# Altium schematic sheet Main.SchDoc: Actuators
size A1; SheetNumber: 1; SheetTotal: 1
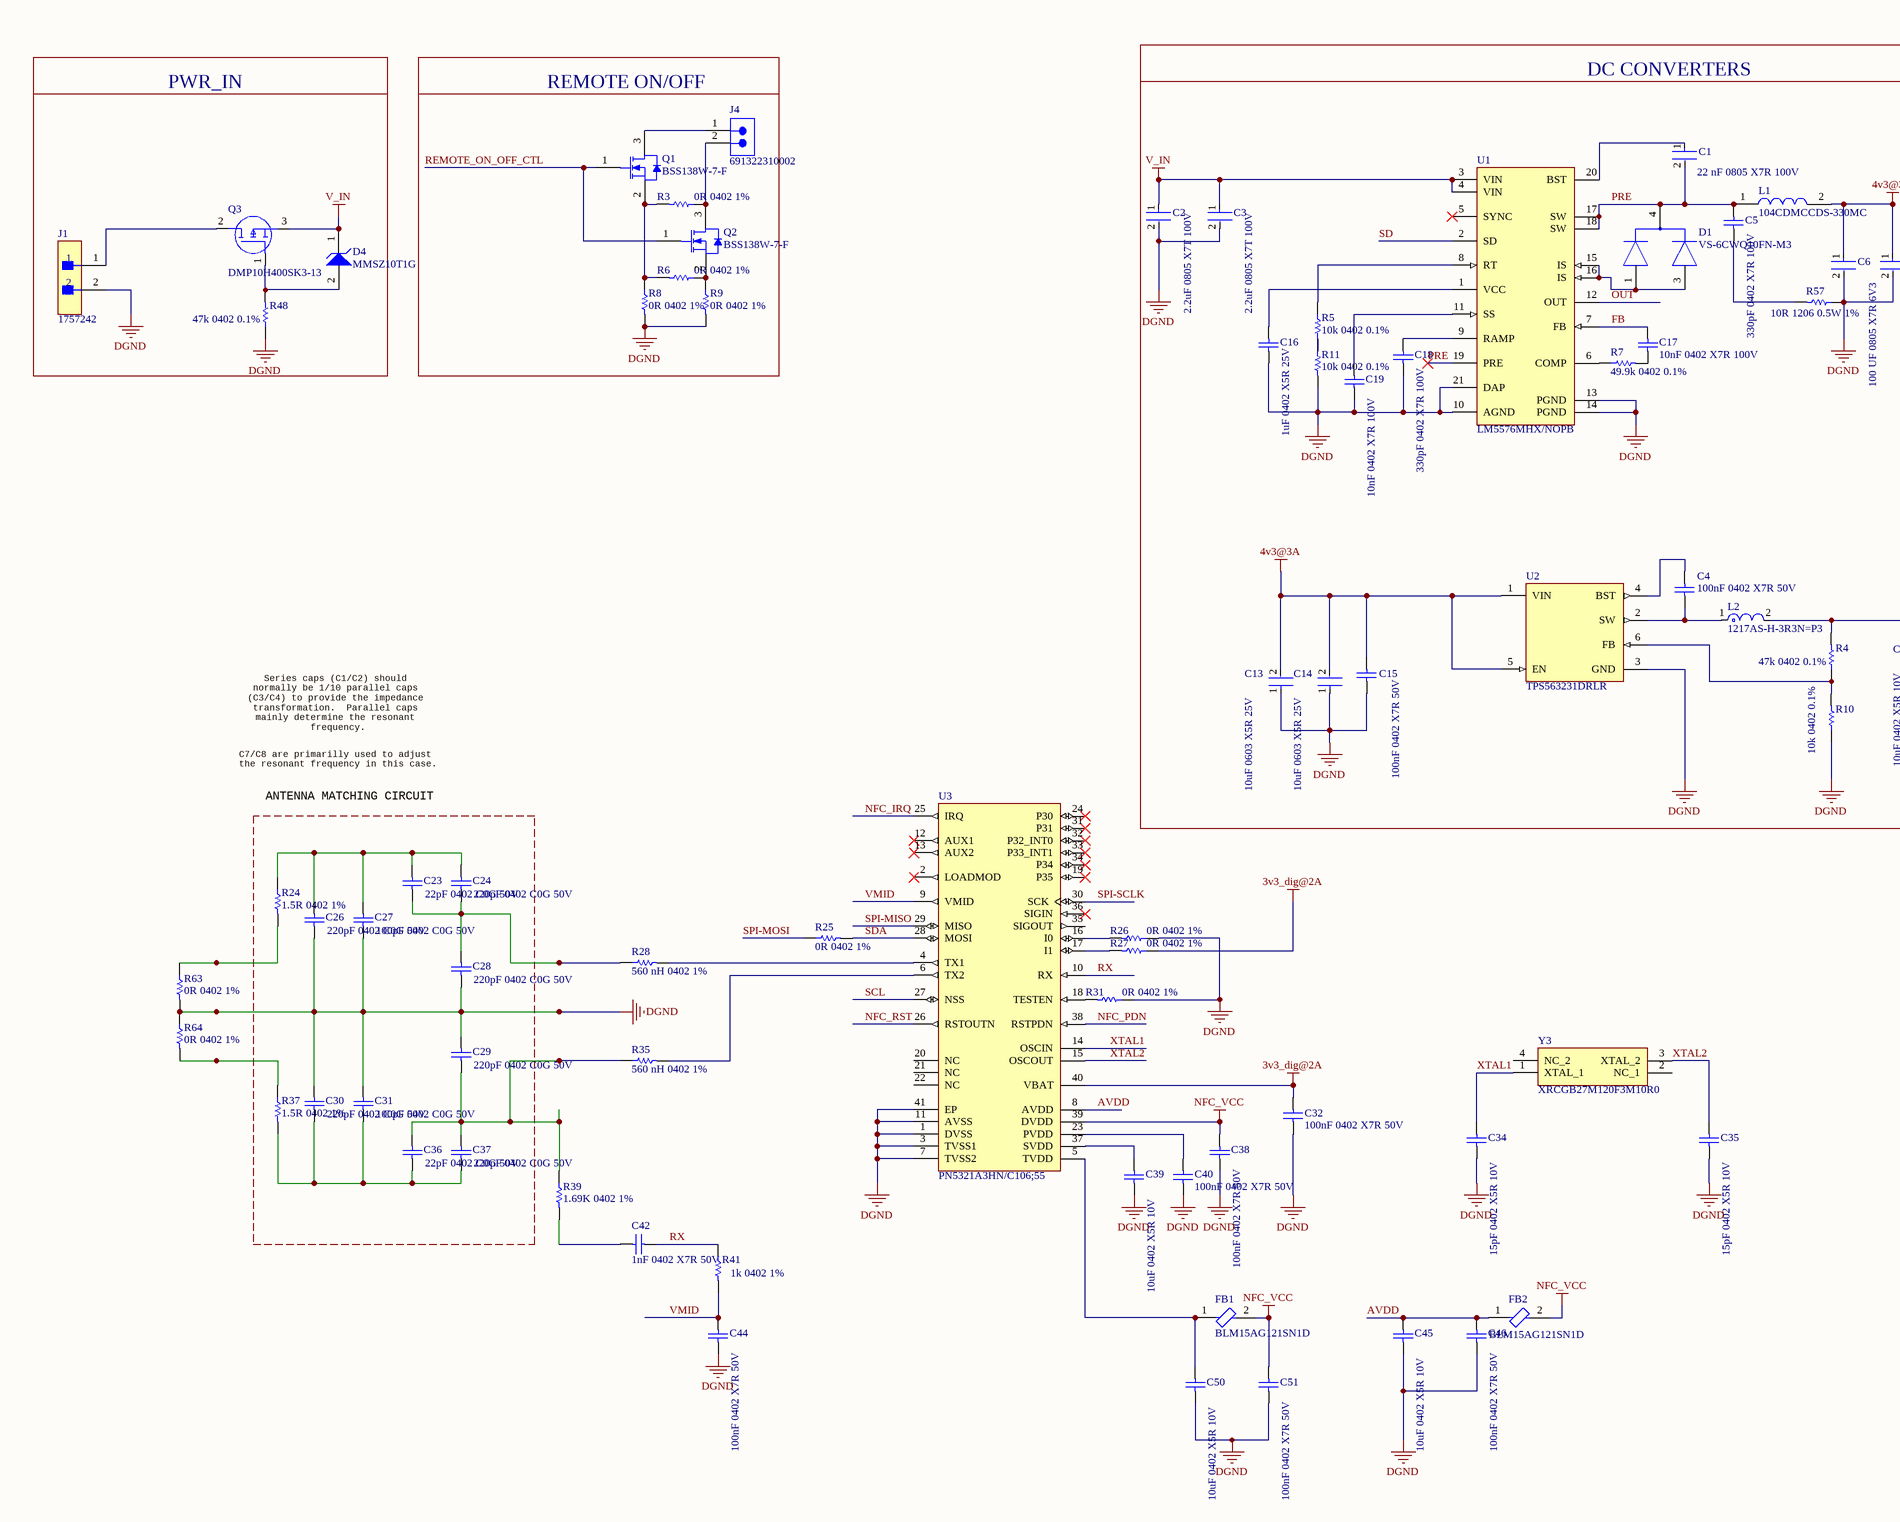
[diagram p0: Main.SchDoc, top left]
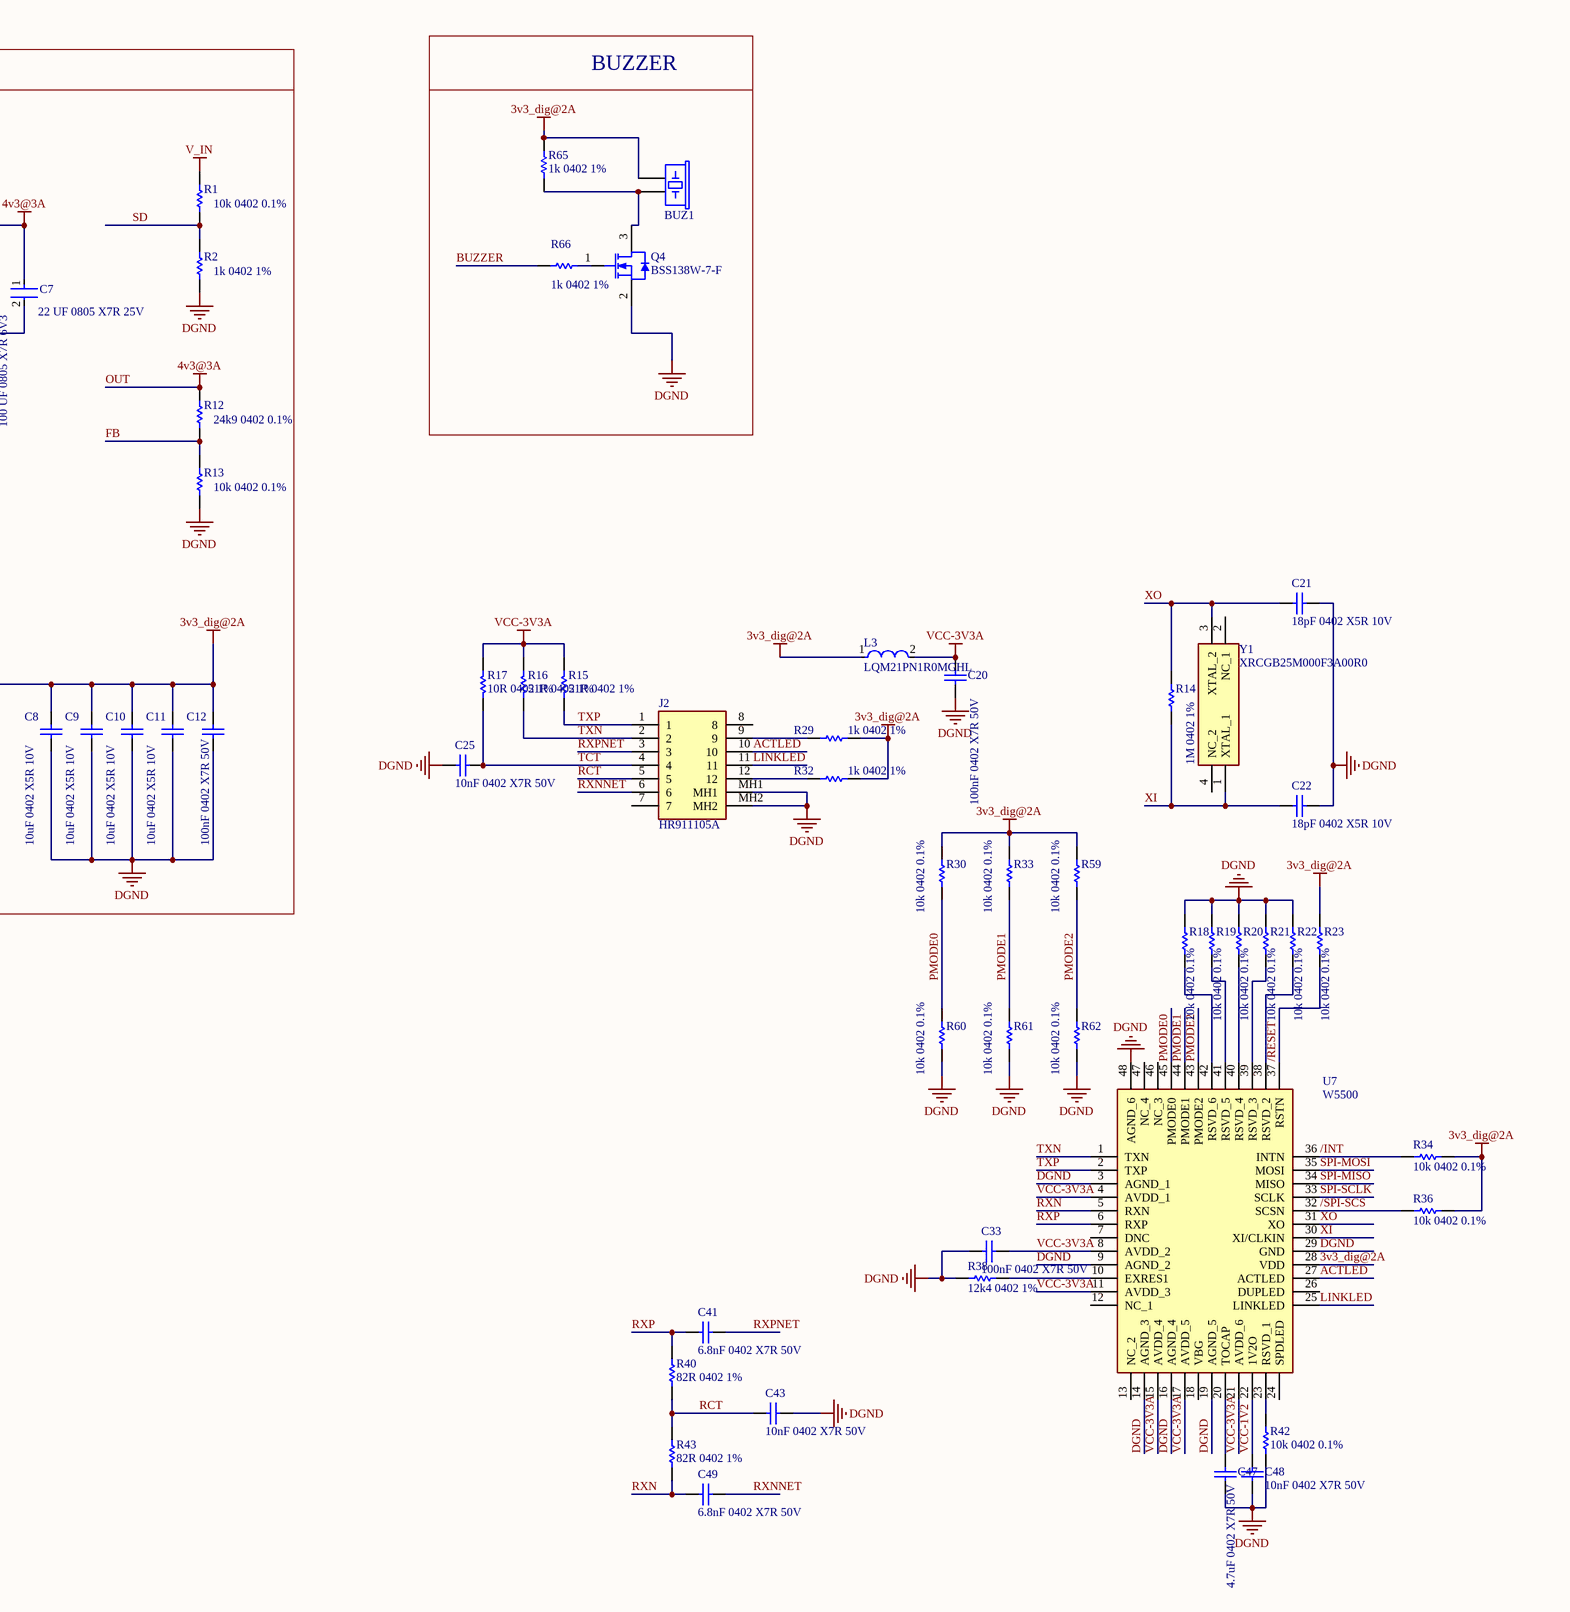
[diagram p1: Main.SchDoc, top right]
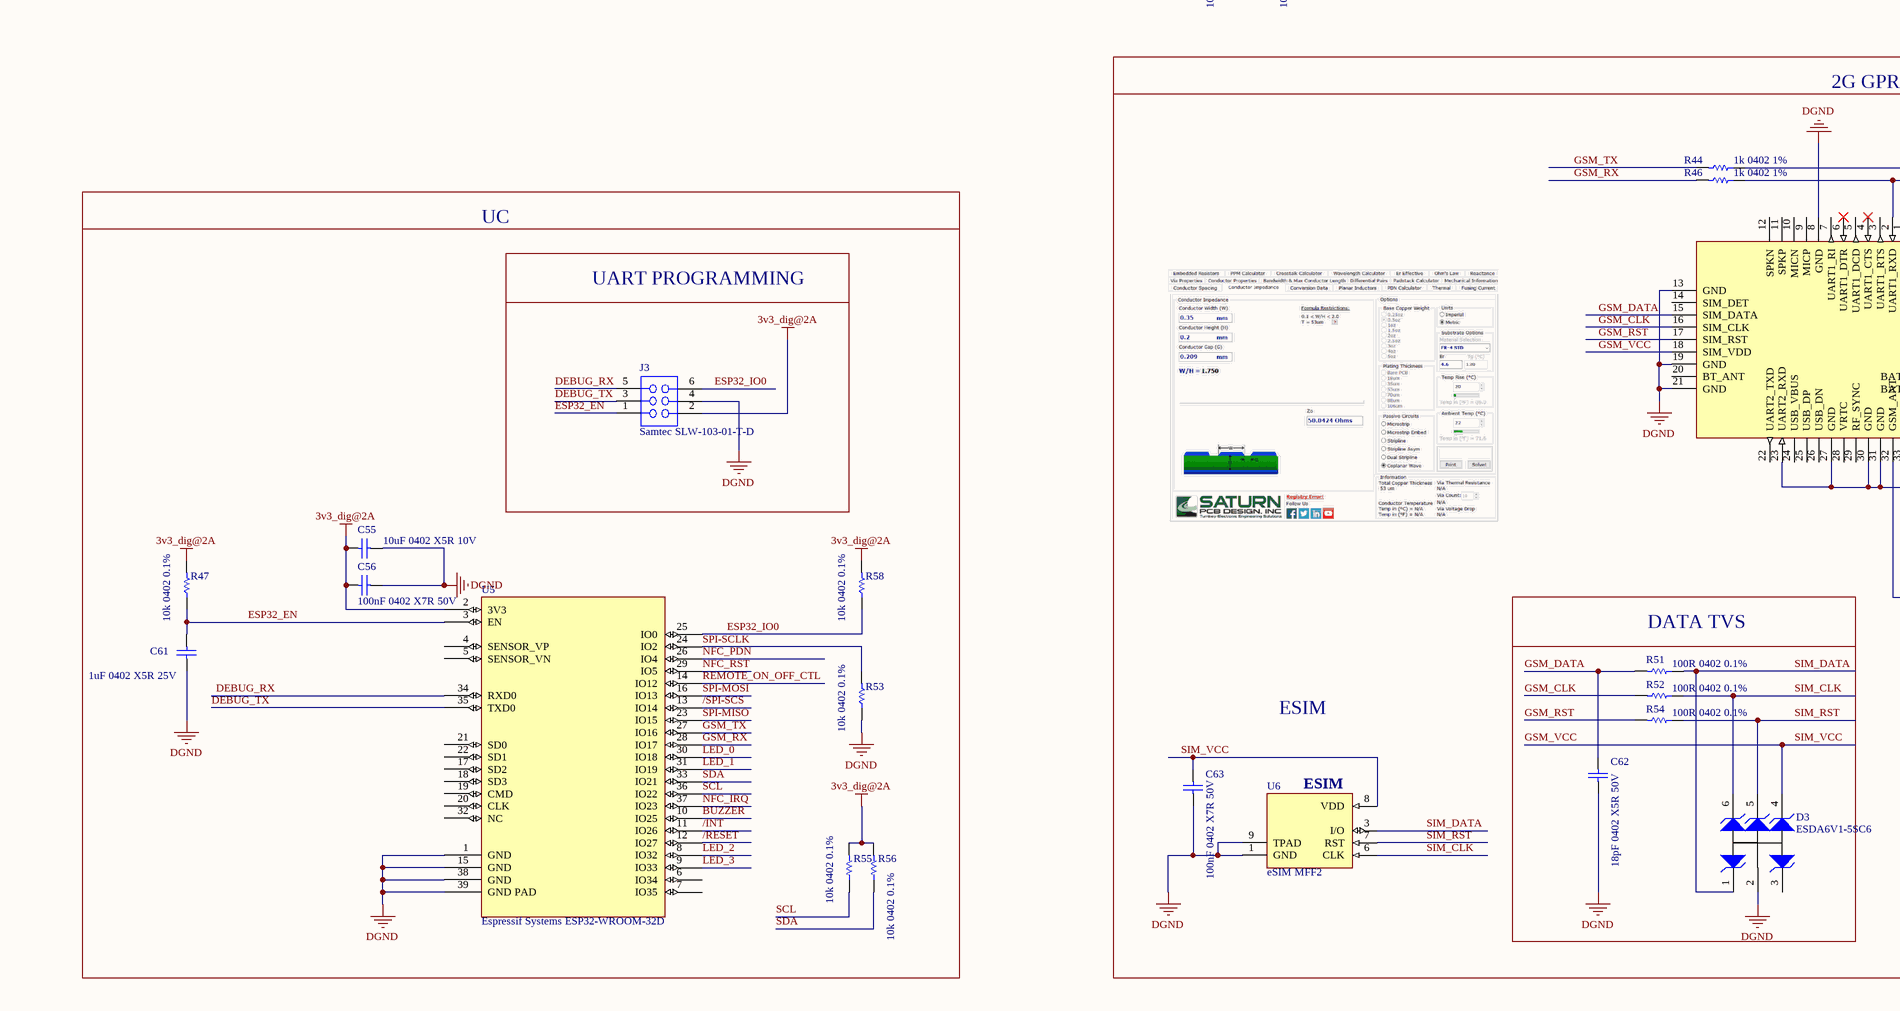
[diagram p2: Main.SchDoc, bottom left]
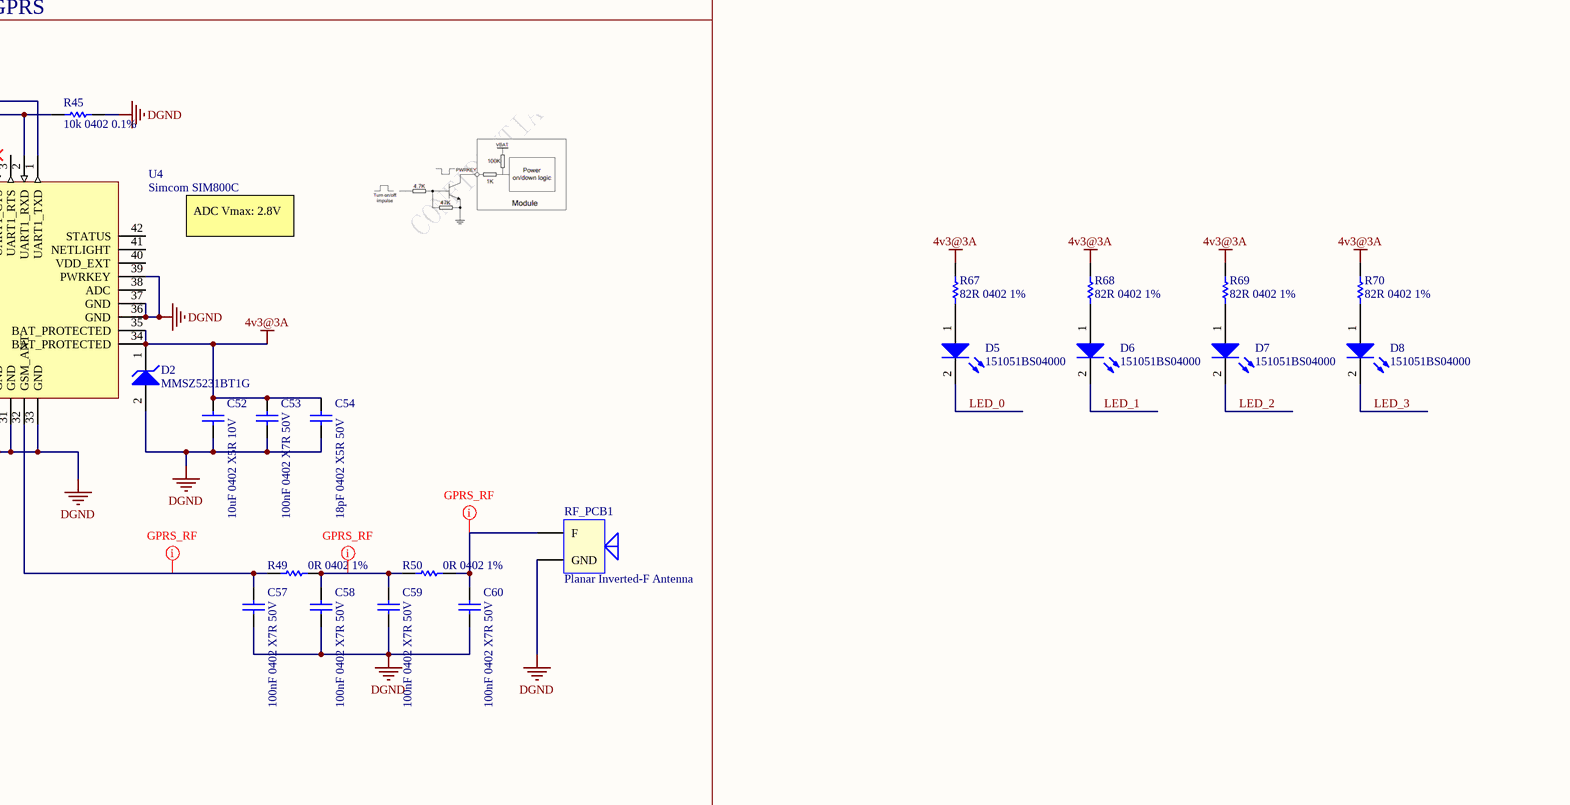
[diagram p3: Main.SchDoc, bottom right]

## Parts
BUZ1  CUI CMT-1285C-035  [BUZZER-12MM-NS]  (value not drawn)
C1  22 nF 0805 X7R 100V  [FP-GRM21B-0_15-IPC_C]
C2  2.2uF 0805 X7T 100V  [FP-GRM21B-0_15-IPC_C]
C3  2.2uF 0805 X7T 100V  [FP-GRM21B-0_15-IPC_C]
C4  100nF 0402 X7R 50V  [CAPC1005X55X25NL5T10]
C5  330pF 0402 X7R 100V  [CAPC1005X55X25NL5T10]
C6  100 UF 0805 X7R 6V3  [FP-GRM21B-0_15-IPC_C]
C7  22 UF 0805 X7R 25V  [FP-GRM21B-0_15-IPC_C]
C8  10uF 0402 X5R 10V  [CAPC1005X55X25NL5T10]
C9  10uF 0402 X5R 10V  [CAPC1005X55X25NL5T10]
C10  10uF 0402 X5R 10V  [CAPC1005X55X25NL5T10]
C11  10uF 0402 X5R 10V  [CAPC1005X55X25NL5T10]
C12  100nF 0402 X7R 50V  [CAPC1005X55X25NL5T10]
C13  10uF 0603 X5R 25V  [FP-GRM188-0_2-IPC_B]
C14  10uF 0603 X5R 25V  [FP-GRM188-0_2-IPC_B]
C15  100nF 0402 X7R 50V  [CAPC1005X55X25NL5T10]
C16  1uF 0402 X5R 25V  [CAPC1005X55X25NL5T10]
C17  10nF 0402 X7R 100V  [CAPC1005X55X25NL5T10]
C18  330pF 0402 X7R 100V  [CAPC1005X55X25NL5T10]
C19  10nF 0402 X7R 100V  [CAPC1005X55X25NL5T10]
C20  100nF 0402 X7R 50V  [CAPC1005X55X25NL5T10]
C21  18pF 0402 X5R 10V  [CAPC1005X55X25NL5T10]
C22  18pF 0402 X5R 10V  [CAPC1005X55X25NL5T10]
C23  22pF 0402 C0G 50V  [CAPC1005X55X25NL5T10]
C24  220pF 0402 C0G 50V  [CAPC1005X55X25NL5T10]
C25  10nF 0402 X7R 50V  [CAPC1005X55X25NL5T10]
C26  220pF 0402 C0G 50V  [CAPC1005X55X25NL5T10]
C27  100pF 0402 C0G 50V  [CAPC1005X55X25NL5T10]
C28  220pF 0402 C0G 50V  [CAPC1005X55X25NL5T10]
C29  220pF 0402 C0G 50V  [CAPC1005X55X25NL5T10]
C30  220pF 0402 C0G 50V  [CAPC1005X55X25NL5T10]
C31  100pF 0402 C0G 50V  [CAPC1005X55X25NL5T10]
C32  100nF 0402 X7R 50V  [CAPC1005X55X25NL5T10]
C33  100nF 0402 X7R 50V  [CAPC1005X55X25NL5T10]
C34  15pF 0402 X5R 10V  [CAPC1005X55X25NL5T10]
C35  15pF 0402 X5R 10V  [CAPC1005X55X25NL5T10]
C36  22pF 0402 C0G 50V  [CAPC1005X55X25NL5T10]
C37  220pF 0402 C0G 50V  [CAPC1005X55X25NL5T10]
C38  100nF 0402 X7R 50V  [CAPC1005X55X25NL5T10]
C39  10uF 0402 X5R 10V  [CAPC1005X55X25NL5T10]
C40  100nF 0402 X7R 50V  [CAPC1005X55X25NL5T10]
C41  6.8nF 0402 X7R 50V  [CAPC1005X55X25NL5T10]
C42  1nF 0402 X7R 50V  [CAPC1005X55X25NL5T10]
C43  10nF 0402 X7R 50V  [CAPC1005X55X25NL5T10]
C44  100nF 0402 X7R 50V  [CAPC1005X55X25NL5T10]
C45  10uF 0402 X5R 10V  [CAPC1005X55X25NL5T10]
C46  100nF 0402 X7R 50V  [CAPC1005X55X25NL5T10]
C47  4.7uF 0402 X7R 50V  [CAPC1005X55X25NL5T10]
C48  10nF 0402 X7R 50V  [CAPC1005X55X25NL5T10]
C49  6.8nF 0402 X7R 50V  [CAPC1005X55X25NL5T10]
C50  10uF 0402 X5R 10V  [CAPC1005X55X25NL5T10]
C51  100nF 0402 X7R 50V  [CAPC1005X55X25NL5T10]
C52  10uF 0402 X5R 10V  [CAPC1005X55X25NL5T10]
C53  100nF 0402 X7R 50V  [CAPC1005X55X25NL5T10]
C54  18pF 0402 X5R 50V  [CAPC1005X55X25NL5T10]
C55  10uF 0402 X5R 10V  [CAPC1005X55X25NL5T10]
C56  100nF 0402 X7R 50V  [CAPC1005X55X25NL5T10]
C57  100nF 0402 X7R 50V  [CAPC1005X55X25NL5T10]
C58  100nF 0402 X7R 50V  [CAPC1005X55X25NL5T10]
C59  100nF 0402 X7R 50V  [CAPC1005X55X25NL5T10]
C60  100nF 0402 X7R 50V  [CAPC1005X55X25NL5T10]
C61  1uF 0402 X5R 25V  [CAPC1005X55X25NL5T10]
C62  18pF 0402 X5R 50V  [CAPC1005X55X25NL5T10]
C63  100nF 0402 X7R 50V  [CAPC1005X55X25NL5T10]
D1  VS-6CWQ10FN-M3  [FP-95627-0]
D2  MMSZ5231BT1G  [ONSC-SOD-123-2-425-04_V]
D3  ESDA6V1-5SC6  [MF06A_N]
D4  MMSZ10T1G  [ONSC-SOD-123-2-425-04_V]
D5  151051BS04000  [WL-TMRC_D5.9H8.7]
D6  151051BS04000  [WL-TMRC_D5.9H8.7]
D7  151051BS04000  [WL-TMRC_D5.9H8.7]
D8  151051BS04000  [WL-TMRC_D5.9H8.7]
FB1  BLM15AG121SN1D  [FP-BLM15-0_05-MFG]
FB2  BLM15AG121SN1D  [FP-BLM15-0_05-MFG]
J1  1757242  [FP-1757242-MFG]
J2  HR911105A  [HR911105A]
J3  Samtec SLW-103-01-T-D  [PCB-37z8hw1ej4f71bosen9e-1]
J4  691322310002  [691322310002]
L1  104CDMCCDS-330MC  [INDPM115100X400N]
L2  1217AS-H-3R3N=P3  [FP-DEM8045C-MFG]
L3  LQM21PN1R0MGHL  [FP-LQM21PH_G0-MFG]
Q1  BSS138W-7-F  [DIOD-SOT323-3_V]
Q2  BSS138W-7-F  [DIOD-SOT323-3_V]
Q3  DMP10H400SK3-13  [DMP10H400SK313]
Q4  BSS138W-7-F  [DIOD-SOT323-3_V]
R1  10k 0402 0.1%  [RESC1005X40X25ML05T10]
R2  1k 0402 1%  [RESC1005X40X25ML05T10]
R3  0R 0402 1%  [RESC1005X40X25ML05T10]
R4  47k 0402 0.1%  [RESC1005X40X25ML05T10]
R5  10k 0402 0.1%  [RESC1005X40X25ML05T10]
R6  0R 0402 1%  [RESC1005X40X25ML05T10]
R7  49.9k 0402 0.1%  [RESC1005X40X25ML05T10]
R8  0R 0402 1%  [RESC1005X40X25ML05T10]
R9  0R 0402 1%  [RESC1005X40X25ML05T10]
R10  10k 0402 0.1%  [RESC1005X40X25ML05T10]
R11  10k 0402 0.1%  [RESC1005X40X25ML05T10]
R12  24k9 0402 0.1%  [RESC1005X40X25ML05T10]
R13  10k 0402 0.1%  [RESC1005X40X25ML05T10]
R14  1M 0402 1%  [RESC1005X40X25ML05T10]
R15  51R 0402 1%  [RESC1005X40X25ML05T10]
R16  51R 0402 1%  [RESC1005X40X25ML05T10]
R17  10R 0402 1%  [RESC1005X40X25ML05T10]
R18  10k 0402 0.1%  [RESC1005X40X25ML05T10]
R19  10k 0402 0.1%  [RESC1005X40X25ML05T10]
R20  10k 0402 0.1%  [RESC1005X40X25ML05T10]
R21  10k 0402 0.1%  [RESC1005X40X25ML05T10]
R22  10k 0402 0.1%  [RESC1005X40X25ML05T10]
R23  10k 0402 0.1%  [RESC1005X40X25ML05T10]
R24  1.5R 0402 1%  [RESC1005X40X25ML05T10]
R25  0R 0402 1%  [RESC1005X40X25ML05T10]
R26  0R 0402 1%  [RESC1005X40X25ML05T10]
R27  0R 0402 1%  [RESC1005X40X25ML05T10]
R28  560 nH 0402 1%  [RESC1005X40X25ML05T10]
R29  1k 0402 1%  [RESC1005X40X25ML05T10]
R30  10k 0402 0.1%  [RESC1005X40X25ML05T10]
R31  0R 0402 1%  [RESC1005X40X25ML05T10]
R32  1k 0402 1%  [RESC1005X40X25ML05T10]
R33  10k 0402 0.1%  [RESC1005X40X25ML05T10]
R34  10k 0402 0.1%  [RESC1005X40X25ML05T10]
R35  560 nH 0402 1%  [RESC1005X40X25ML05T10]
R36  10k 0402 0.1%  [RESC1005X40X25ML05T10]
R37  1.5R 0402 1%  [RESC1005X40X25ML05T10]
R38  12k4 0402 1%  [RESC1005X40X25ML05T10]
R39  1.69K 0402 1%  [RESC1005X40X25ML05T10]
R40  82R 0402 1%  [RESC1005X40X25ML05T10]
R41  1k 0402 1%  [RESC1005X40X25ML05T10]
R42  10k 0402 0.1%  [RESC1005X40X25ML05T10]
R43  82R 0402 1%  [RESC1005X40X25ML05T10]
R44  1k 0402 1%  [RESC1005X40X25ML05T10]
R45  10k 0402 0.1%  [RESC1005X40X25ML05T10]
R46  1k 0402 1%  [RESC1005X40X25ML05T10]
R47  10k 0402 0.1%  [RESC1005X40X25ML05T10]
R48  47k 0402 0.1%  [RESC1005X40X25ML05T10]
R49  0R 0402 1%  [RESC1005X40X25ML05T10]
R50  0R 0402 1%  [RESC1005X40X25ML05T10]
R51  100R 0402 0.1%  [RESC1005X40X25ML05T10]
R52  100R 0402 0.1%  [RESC1005X40X25ML05T10]
R53  10k 0402 0.1%  [RESC1005X40X25ML05T10]
R54  100R 0402 0.1%  [RESC1005X40X25ML05T10]
R55  10k 0402 0.1%  [RESC1005X40X25ML05T10]
R56  10k 0402 0.1%  [RESC1005X40X25ML05T10]
R57  10R 1206 0.5W 1%  [CAPC3216X180X55ML20T25]
R58  10k 0402 0.1%  [RESC1005X40X25ML05T10]
R59  10k 0402 0.1%  [RESC1005X40X25ML05T10]
R60  10k 0402 0.1%  [RESC1005X40X25ML05T10]
R61  10k 0402 0.1%  [RESC1005X40X25ML05T10]
R62  10k 0402 0.1%  [RESC1005X40X25ML05T10]
R63  0R 0402 1%  [RESC1005X40X25ML05T10]
R64  0R 0402 1%  [RESC1005X40X25ML05T10]
R65  1k 0402 1%  [RESC1005X40X25ML05T10]
R66  1k 0402 1%  [RESC1005X40X25ML05T10]
R67  82R 0402 1%  [RESC1005X40X25ML05T10]
R68  82R 0402 1%  [RESC1005X40X25ML05T10]
R69  82R 0402 1%  [RESC1005X40X25ML05T10]
R70  82R 0402 1%  [RESC1005X40X25ML05T10]
RF_PCB1  Planar Inverted-F Antenna  [PCB-k9titb4465gfk1ijwrnj-1]  (no BOM)
U1  LM5576MHX/NOPB  [PWP0020A_M]
U2  TPS563231DRLR  [FP-DRL0006A-MFG]
U3  PN5321A3HN/C106;55  [NXP-HVQFN-40_M]
U4  Simcom SIM800C  [SIM800C]
U5  Espressif Systems ESP32-WROOM-32D  [PCB-1htnvixwtci0bg563is1-1]
U6  eSIM MFF2  [SON127P600X95_HS-9N]
U7  W5500  [QFP50P900X900X160-48N]
Y1  XRCGB25M000F3A00R0  [XRCGB]
Y3  XRCGB27M120F3M10R0  [XRCGB]

## Blocks framed on the sheet
PWR_IN: D4 J1 Q3 R48
REMOTE ON/OFF: J4 Q1 Q2 R3 R6 R8 R9
DC CONVERTERS: C1-C19 D1 L1 L2 R1 R2 R4 R5 R7 R10-R13 R57 U1 U2
BUZZER: BUZ1 Q4 R65 R66
ANTENNA MATCHING CIRCUIT: C23 C24 C26-C31 C36 C37 R24 R37
UC: C55 C56 C61 R47 R53 R55 R56 R58 U5
UART PROGRAMMING: J3
DATA TVS: C62 D3 R51 R52 R54

## Nets
3v3_dig@2A: BUZ1.1(+) C8.2 C9.2 C10.2 C11.2 C12.2 C32.1 C55.2 C56.2 J3.2 L2.2 L3.1 R4.2 R23.1 R27.1 R29.1 R30.2 R32.1 R33.2 R34.2 R36.2 R47.2 R55.2 R56.2 R58.2 R59.2 R65.1 U3.40(VBAT) U5.2(3V3) U7.28(VDD)
DGND: C2.2 C3.2 C6.2 C7.2 C8.1 C9.1 C10.1 C11.1 C12.1 C13.1 C14.1 C15.1 C16.1 C18.2 C19.2 C20.2 C21.2 C22.2 C25.2 C26.2 C27.2 C28.2 C29.1 C30.1 C31.1 C32.2 C33.1 C34.2 C35.2 C38.2 C39.2 C40.2 C43.2 C44.2 C45.2 C46.2 C47.1 C48.1 C50.2 C51.2 C52.1 C53.1 C54.1 C55.1 C56.1 C57.1 C58.1 C59.1 C60.1 C61.1 C62.1 C63.1 D2.2(A) D3.2(K) J1.2 J2.MH1 J2.MH2 J3.4 Q4.2(S) R2.2 R8.2 R9.2 R10.1 R11.2 R13.1 R18.1 R19.1 R20.1 R21.1 R22.1 R26.1 R31.1 R38.1 R42.1 R45.1 R48.1 R53.1 R57.1 R60.1 R61.1 R62.1 R63.2 R64.1 RF_PCB1.2(GND) U1.10(AGND) U1.13(PGND) U1.14(PGND) U1.21(DAP) U2.3(GND) U3.1(DVSS) U3.3(TVSS1) U3.7(TVSS2) U3.11(AVSS) U3.41(EP) U4.8(GND) U4.13(GND) U4.19(GND) U4.21(GND) U4.23(UART2_RXD) U4.27(GND) U4.30(GND) U4.31(GND) U4.33(GND) U4.36(GND) U4.37(GND) U4.39(PWRKEY) U5.1(GND) U5.15(GND) U5.38(GND) U5.39(GND_PAD) U6.1(GND) U6.9(TPAD) U7.3(AGND_1) U7.9(AGND_2) U7.14(AGND_3) U7.16(AGND_4) U7.19(AGND_5) U7.29(GND) U7.48(AGND_6)
NFC_VCC: C38.1 C51.1 FB1.2 FB2.2 U3.39(DVDD)
OUT: C6.1 C7.1 C13.2 C14.2 C15.2 C52.2 C53.2 C54.2 D2.1(K) L1.2 R12.2 R67.1 R68.1 R69.1 R70.1 U1.12(OUT) U2.1(VIN) U2.5(EN) U4.34(BAT_PROTECTED) U4.35(BAT_PROTECTED)  [also labelled 4v3@3A]
V_IN: C2.1 C3.1 D4.1(K) Q3.3(S) R1.2 U1.3(VIN) U1.4(VIN)
VCC-3V3A: C20.1 C33.2 L3.2 R15.1 R16.1 R17.1 U7.4(AVDD_1) U7.8(AVDD_2) U7.11(AVDD_3) U7.15(AVDD_4) U7.17(AVDD_5) U7.21(AVDD_6)
/INT: R34.1 U5.11(IO26) U7.36(INTN)
/RESET: R23.2 U5.12(IO27) U7.37(RSTN)
/SPI-SCS: R36.1 U5.13(IO14) U7.32(SCSN)
ACTLED: J2.10 U7.27(ACTLED)
AVDD: C45.1 C46.1 FB2.1 U3.8(AVDD)
BUZZER: R66.2 U5.10(IO25)
DEBUG_RX: J3.5 U5.34(RXD0)
DEBUG_TX: J3.3 U5.35(TXD0)
ESP32_EN: C61.2 J3.1 R47.1 U5.3(EN)
ESP32_IO0: J3.6 R58.1 U5.25(IO0)
FB: C17.1 R12.1 R13.2 U1.7(FB)
GSM_CLK: R52.2 U4.16(SIM_CLK)
GSM_DATA: C62.2 R51.2 U4.15(SIM_DATA)
GSM_RST: R54.2 U4.17(SIM_RST)
GSM_RX: R46.2 U5.28(IO17)
GSM_TX: R44.2 U5.27(IO16)
GSM_VCC: C63.2 D3.4(A) U4.18(SIM_VDD) U6.8(VDD)  [also labelled SIM_VCC]
LED_0: D5.2(K) U5.30(IO18)
LED_1: D6.2(K) U5.31(IO19)
LED_2: D7.2(K) U5.8(IO32)
LED_3: D8.2(K) U5.9(IO33)
LINKLED: J2.11 U7.25(LINKLED)
NFC_IRQ: U3.25(IRQ) U5.37(IO23)
NFC_PDN: U3.38(RSTPDN) U5.26(IO4)
NFC_RST: U3.26(RSTOUTN) U5.29(IO5)
PMODE0: R30.1 R60.2 U7.45(PMODE0)
PMODE1: R33.1 R61.2 U7.44(PMODE1)
PMODE2: R59.1 R62.2 U7.43(PMODE2)
PRE: C1.2 C5.1 D1.4(Common_cathode) L1.1 U1.17(SW) U1.18(SW) U1.19(PRE)
RCT: C43.1 J2.5 R40.2 R43.1
REMOTE_ON_OFF_CTL: Q1.1(G) Q2.1(G) U5.14(IO12)
RX: C42.2 R41.1 U3.10(RX)
RXN: C49.1 R43.2 U7.5(RXN)
RXNNET: C49.2 J2.6
RXP: C41.1 R40.1 U7.6(RXP)
RXPNET: C41.2 J2.3
SCL: R55.1 U3.27(NSS) U5.36(IO22)
SD: R1.1 R2.1 U1.2(SD)
SDA: R25.2 R56.1 U3.28(MOSI) U5.33(IO21)
SIM_CLK: D3.6(A) R52.1 U6.6(CLK)
SIM_DATA: D3.1(K) R51.1 U6.3(I/O)
SIM_RST: D3.5(A) R54.1 U6.7(RST)
SPI-MISO: U3.29(MISO) U5.23(IO15) U7.34(MISO)
SPI-MOSI: R25.1 U5.16(IO13) U7.35(MOSI)
SPI-SCLK: R53.2 U3.30(SCK) U5.24(IO2) U7.33(SCLK)
TCT: C25.1 J2.4 R17.2
TXN: J2.2 R16.2 U7.1(TXN)
TXP: J2.1 R15.2 U7.2(TXP)
VCC-1V2: C48.2 U7.22(1V2O)
VMID: C44.1 R41.2 U3.9(VMID)
XI: C22.1 R14.2 U7.30(XI/CLKIN) Y1.1(XTAL_1)
XO: C21.1 R14.1 U7.31(XO) Y1.3(XTAL_2)
XTAL1: C34.1 U3.14(OSCIN) Y3.1(XTAL_1)
XTAL2: C35.1 U3.15(OSCOUT) Y3.3(XTAL_2)
NetBUZ1_2: BUZ1.2(-) Q4.3(D) R65.2
NetC1_1: C1.1 U1.20(BST)
NetC4_1: C4.1 L2.1 U2.2(SW)
NetC4_2: C4.2 U2.4(BST)
NetC5_2: C5.2 R57.2
NetC16_2: C16.2 U1.1(VCC)
NetC17_2: C17.2 R7.2
NetC18_1: C18.1 U1.9(RAMP)
NetC19_1: C19.1 U1.11(SS)
NetC23_1: C23.1 C24.1 C26.1 C27.1 R24.1
NetC23_2: C23.2 C24.2 C28.1 R28.1
NetC29_2: C29.2 C36.1 C37.1 R35.1 R39.1
NetC30_2: C30.2 C31.2 C36.2 C37.2 R37.2
NetC39_1: C39.1 U3.37(SVDD)
NetC40_1: C40.1 U3.23(PVDD)
NetC42_1: C42.1 R39.2
NetC47_2: C47.2 U7.20(TOCAP)
NetC50_1: C50.1 FB1.1 U3.5(TVDD)
NetC57_2: C57.2 R49.2 U4.32(GSM_ANT)
NetC58_2: C58.2 C59.2 R49.1 R50.2
NetC60_2: C60.2 R50.1 RF_PCB1.1(F)
NetD1_1: D1.1(1_Anode) D1.3(2_Anode) U1.15(IS) U1.16(IS)
NetD4_2: D4.2(A) Q3.1(G) R48.2
NetD5_1: D5.1(A) R67.2
NetD6_1: D6.1(A) R68.2
NetD7_1: D7.1(A) R69.2
NetD8_1: D8.1(A) R70.2
NetJ1_1: J1.1 Q3.2(D)
NetJ2_9: J2.9 R29.2
NetJ2_12: J2.12 R32.2
NetJ4_1: J4.1 Q1.3(D)
NetJ4_2: J4.2 Q2.3(D) R3.1
NetQ1_2: Q1.2(S) R3.2 R6.2 R8.1
NetQ2_2: Q2.2(S) R6.1 R9.1
NetQ4_1: Q4.1(G) R66.1
NetR4_1: R4.1 R10.2 U2.6(FB)
NetR5_1: R5.1 U1.8(RT)
NetR5_2: R5.2 R11.1
NetR7_1: R7.1 U1.6(COMP)
NetR18_2: R18.2 U7.42(RSVD_6)
NetR19_2: R19.2 U7.41(RSVD_5)
NetR20_2: R20.2 U7.40(RSVD_4)
NetR21_2: R21.2 U7.39(RSVD_3)
NetR22_2: R22.2 U7.38(RSVD_2)
NetR24_2: R24.2 R63.1
NetR26_2: R26.2 U3.16(I0)
NetR27_2: R27.2 U3.17(I1)
NetR28_2: R28.2 U3.4(TX1)
NetR31_2: R31.2 U3.18(TESTEN)
NetR35_2: R35.2 U3.6(TX2)
NetR37_1: R37.1 R64.2
NetR38_2: R38.2 U7.10(EXRES1)
NetR42_2: R42.2 U7.23(RSVD_1)
NetR44_1: R44.1 U4.1(UART1_TXD)
NetR45_2: R45.2 R46.1 U4.2(UART1_RXD)

Not connected (* = marked no-connect by the designer): D3 3(K); J2 7 8; U1 5(SYNC)*; U3 2(LOADMOD)* 12(AUX1)* 13(AUX2)* 19(P35)* 20(NC) 21(NC) 22(NC) 24(P30)* 31(P31)* 32(P32_INT0)* 33(P33_INT1)* 34(P34)* 35(SIGOUT) 36(SIGIN)*; U4 3(UART1_RTS) 4(UART1_CTS)* 5(UART1_DCD) 6(UART1_DTR)* 7(UART1_RI) 9(MICP) 10(MICN) 11(SPKP) 12(SPKN) 14(SIM_DET) 20(BT_ANT) 22(UART2_TXD) 24(USB_VBUS) 25(USB_DP) 26(USB_DN) 28(VRTC) 29(RF_SYNC) 38(ADC) 40(VDD_EXT) 41(NETLIGHT) 42(STATUS); U5 4(SENSOR_VP) 5(SENSOR_VN) 6(IO34) 7(IO35) 17(SD2) 18(SD3) 19(CMD) 20(CLK) 21(SD0) 22(SD1) 32(NC); U7 7(DNC) 12(NC_1) 13(NC_2) 18(VBG) 24(SPDLED) 26(DUPLED) 46(NC_3) 47(NC_4); Y1 2(NC_1) 4(NC_2); Y3 2(NC_1) 4(NC_2)

## Layout directives
net class GPRS_RF: NetC57_2, NetC58_2, NetC60_2

## Notes on the sheet
- Series caps (C1/C2) should
  normally be 1/10 parallel caps
  (C3/C4) to provide the impedance
  transformation.  Parallel caps
  mainly determine the resonant
  frequency.
- C7/C8 are primarilly used to adjust
  the resonant frequency in this case.
- 2G GPRS
- ADC Vmax: 2.8V
- ESIM
- (near U6) ESIM
- Title
- Size:
- Date:
- A3
- Author:
- Time:
- Revision:
- Sheet
- of
- File:

## Library data of the parts
BUZ1 = CMP-581a9557be5887dd-1: Audio Buzzer Magnetic 3Vo-p 5Vo-p 70mA 3.5Vo-p 85dB Through Hole Pin Tray; Lead-Free Status: Lead Free; Octopart URL: https://octopart.com/cmt-1285c-035-cui-71811876; Manufacturer Part Number: CMT-1285C-035; Mounting Style: Through Hole; RoHS: Compliant; OctopartID: 581a9557be5887dd; Manufacturer Part Number 2: GMC1205YA-16R2048; LCSC_PN: C252915
C1 C6 = CMP-2007-03541-2: Voltage: 25V; Material: Ceramic; Dielectric: X5R; Capacitance: 10uF; Tolerance: 10%; Length: 2mm; Depth: 1.25mm; Termination: SMD/SMT; Height: 1.25mm; Thickness: 0.053inch; Radiation Hardening: No; Min Operating Temperature: -55°C; Width: 0.049inch; Package Quantity: 1; Mount: Surface Mount; Packaging: Tape and Reel; Voltage Rating (DC): 25V; Lead Free: Lead Free; Max Operating Temperature: 85°C; Case Code (Imperial): 0805; Case/Package: 0805; Voltage Rating: 25V; Case Code (Metric): 2012
  C1: LCSC_PN: C107137
  C6: LCSC_PN: C141660
C2 C3 = CMP-2007-03541-2: Chip Multilayer Ceramic Capacitors for General Purpose, 0805, 2.2uF, X7T, 15%, 10%, 100V; Voltage: 25V; Dielectric: X5R; Capacitance: 10uF; Length: 2mm; Depth: 1.25mm; Termination: SMD/SMT; Height: 1.25mm; Material: Ceramic; Thickness: 0.053inch; Radiation Hardening: No; Min Operating Temperature: -55°C; Width: 0.049inch; Package Quantity: 1; Mount: Surface Mount; Packaging: Tape and Reel; Voltage Rating (DC): 25V; Lead Free: Lead Free; Max Operating Temperature: 85°C; Case Code (Imperial): 0805; Case/Package: 0805; Tolerance: 10%; Voltage Rating: 25V; Case Code (Metric): 2012; LCSC_PN: C2981733
C4 C5 C8-C12 C15-C63 = CMP-1662-00020-1: ComponentLink2Description: Datasheet; ComponentLink2URL: http://psearch.en.murata.com/capacitor/product/GRM155R60J105KE19%23.pdf; ComponentLink1Description: Manufacturer URL; ComponentLink1URL: http://www.murata.com/
  C4 C12 C15 C20 C32 C33 C38 C40 C44 C46 C51 C53 C56-C60 C63: LCSC_PN: C77020
  C5 C18: LCSC_PN: C5125804
  C8-C11 C39 C45 C50 C52 C55: LCSC_PN: C77000
  C16 C61: LCSC_PN: C77009
  C17 C19: LCSC_PN: C527014
  C21 C22: LCSC_PN: C161534
  C23 C36: LCSC_PN: C76960
  C24 C26 C28-C30 C37: LCSC_PN: C71693
  C25 C43 C48: LCSC_PN: C527026
  C27 C31: LCSC_PN: C77177
  C34 C35: LCSC_PN: C384680
  C41 C49: LCSC_PN: C93654
  C42: LCSC_PN: C106205
  C47: LCSC_PN: C76995
  C54 C62: LCSC_PN: C33149
C7 = CMP-2007-03541-2: Material: Ceramic; Dielectric: X5R; Capacitance: 10uF; Tolerance: 10%; Length: 2mm; Depth: 1.25mm; Termination: SMD/SMT; Voltage: 25V; Height: 1.25mm; Thickness: 0.053inch; Radiation Hardening: No; Min Operating Temperature: -55°C; Width: 0.049inch; Package Quantity: 1; Mount: Surface Mount; Packaging: Tape and Reel; Voltage Rating (DC): 25V; Lead Free: Lead Free; Max Operating Temperature: 85°C; Case Code (Imperial): 0805; Case/Package: 0805; Voltage Rating: 25V; Case Code (Metric): 2012; LCSC_PN: C45783
C13 C14 = CMP-06035-022879-1: LCSC_PN: C91606
D1 = CMP-00030-20473304-1: VS-6CWQ10FN-M3 Rectifier Diode, Schottky, 1 Phase, 2 Element, 7A, 100V V(RRM), Silicon, TO-252AA; Manufacturer Package Identifier: 95627; Forward Voltage: 960mV; Average Rectified Current: 3.5A; Capacitance: 92pF; Element Configuration: Common Cathode; Peak Non-Repetitive Surge Current: 440A; Peak Reverse Current: 1mA; Max Junction Temperature (Tj): 150°C; Reverse Voltage: 100V; Number of Pins: 3; Forward Current: 7A; Max Repetitive Reverse Voltage (Vrrm): 100V; Min Operating Temperature: -40°C; Max Operating Temperature: 150°C; Height: 2.39mm; Case/Package: DPAK; Max Reverse Voltage (DC): 100V; Width: 6.22mm; Length: 6.73mm; Mount: Surface Mount; RoHS: Compliant; Max Forward Surge Current (Ifsm): 440A; NexarPartId: 20473304; Schedule B: 8541100080, 8541100080; LCSC_PN: C3759619
D2 = CMP-1060-00573-1: Zener Voltage Regulator, 500 mW, 2-Pin SOD-123, Pb-Free, Tape and Reel; Manufacturer: On Semiconductor; P Max (W): 0.5; VZ Typ (V): 5.1; PackageVersion: Rev. G, 10/2009; Mounting Technology: Surface Mount; ComponentLink2Description: Datasheet; ComponentLink3URL: http://www.onsemi.com/pub_link/Collateral/425-04.PDF; PackageDescription: 2-Pin SOD, Body 1.6 x 2.69 mm; Packing: Tape and Reel; ComponentLink2URL: http://www.onsemi.com/pub_link/Collateral/MMSZ5221BT1-D.PDF; ComponentLink1URL: http://www.onsemi.com/; PartNumber: MMSZ5231BT1G; PackageReference: SOD-123-2-425-04; RoHS: Pb-Free; ComponentLink1Description: Manufacturer URL; ComponentLink3Description: Package Specification; DatasheetVersion: Rev. 12; LCSC_PN: C66198
D3 = CMP-924f5b40f9684d88-1: ESDA Series 5 Channel 6.1 V 50 pF SMT Uni Directional Transil Array - SOT-23-6L; Operating Voltage: 6.10 V; Power Rating: 100 W; Breakdown Voltage: 7.20 V; Lead-Free Status: Lead Free; REACH SVHC Compliance: No SVHC; Number of Pins: 6; Case/Package: SOT-23; Size-Width: 1.75 mm; Mounting Style: Surface Mount; Manufacturer Part Number: ESDA6V1-5SC6; Size-Height: 1.45 mm; OctopartID: 924f5b40f9684d88; Size-Length: 3.05 mm; Packaging: Tape & Reel (TR), Cut Tape (CT); Octopart URL: http://octopart.com/esda6v1-5sc6-stmicroelectronics-347713; RoHS: Compliant; Voltage Rating (DC): 6.10 V; Lifecycle Status: Active; TME: ESDA6V1-5SC6; LCSC_PN: C6650
D4 = CMP-1060-00410-1: Zener Voltage Regulator, 500 mW, 2-Pin SOD-123, Pb-Free, Tape and Reel; Manufacturer: On Semiconductor; P Max (W): 0.5; ComponentLink1URL: http://www.onsemi.com/; RoHS: Pb-Free; ComponentLink3Description: Package Specification; Packing: Tape and Reel; PackageVersion: Rev. G, 10/2009; ComponentLink3URL: http://www.onsemi.com/pub_link/Collateral/425-04.PDF; PartNumber: MMSZ10T1G; ComponentLink2Description: Datasheet; Mounting Technology: Surface Mount; PackageReference: SOD-123-2-425-04; DatasheetVersion: Rev. 11; ComponentLink1Description: Manufacturer URL; ComponentLink2URL: http://www.onsemi.com/pub_link/Collateral/MMSZ2V4T1-D.PDF; PackageDescription: 2-Pin SOD, Body 1.6 x 2.69 mm; LCSC_PN: C236094
D5-D8 = CMP-1488-00009-2: NexarPartId: 29717812; Test Current: 20mA; Forward Voltage: 3.2V; Wavelength: 470nm; Lens Size: 5mm; Lens Style: Circular, Diffused, Round; Forward Current: 100mA; Peak Wavelength: 465nm; Viewing Angle: 40°; Luminous Intensity: 500mcd; Max Reverse Voltage (DC): 5V; Color: Blue; Case/Package: Radial; Width: 5mm; Mount: Through Hole; Min Operating Temperature: -40°C; Length: 5mm; Height: 8.6mm; Max Operating Temperature: 85°C; Packaging: Bulk; RoHS: Compliant; REACH SVHC: Unknown; Dominant Wavelength: 470nm; LCSC_PN: C2895496
FB1 FB2 = CMP-0686-00170-4: Chip Ferrite Bead, 0402, 120Ω @ 100MHz, 0.19Ω, 25%, 550mA; Material: Steel; Max DC Current: 500mA; Shielding: Unshielded; Number of Lines: 1; DC Resistance (DCR): 190mR; Impedance: 120R; Packaging: Tape and Reel; Core Material: Ferrite; Number of Pins: 2; Tolerance: 25%; Case Code (Imperial): 0402; DC Current: 500mA; Termination: SMD/SMT; Height: 0.5mm; REACH SVHC: No SVHC; Max Operating Temperature: 125°C; Case Code (Metric): 1005; Length: 1mm; Test Frequency: 100MHz; Lead Free: Lead Free; Depth: 0.55mm; Max Current Rating: 550mA; Case/Package: 0402; Min Operating Temperature: -55°C; Width: 0.5mm; Military Standard: Not; Frequency: 100MHz; Current Rating: 550mA; Package Quantity: 1; Number of Circuits: 1; Radiation Hardening: No; LCSC_PN: C316452
J1 = CMP-09399-000010-1: TERM BLOCK HDR 2POS 90DEG 5.08MM; Number of Poles: 2; Voltage Rating (DC): 320V; Number of Levels: 1; Voltage Rating: 250V; Current: 15A; Gender: Male; Current Rating: 12A; Voltage: 300V; Approvals: UL; Connector Type: Plug; Package Quantity: 50; Weight: 5.396916oz; Mount: Through Hole; Lead Free: Lead Free; Depth: 12mm; Contact Plating: Tin; Housing Material: PBT; Color: Grey; REACH SVHC: No SVHC; Number of Contacts: 2; Flammability Rating: UL94 V-0; Length: 12.16mm; Housing Color: Green; RoHS Compliant: Yes; Contact Material: Tin; Height: 12.08mm; Orientation: Right Angle; Termination: Solder; Pitch: 5.08mm; Number of Positions: 2; Packaging: Bulk; Number of Rows: 1; Number of Positions Per Level: 2; Width: 12.1mm; Max Current Rating: 12A; Series: MSTBA; LCSC_PN: C3697
J2 = HR911105A: Connector; Manufacturer_Name: Hanrun Electronics; Datasheet Link: https://datasheet.lcsc.com/szlcsc/Zhongshan-HanRun-Elec-HR911105A_C12074.pdf; Height: 13.75mm; Manufacturer_Part_Number: HR911105A; LCSC_PN: C12074
J3 = CMP-bcf575fbeff46332-1: Dual Row Connector Female Samtec SLW-103-01-T-D; Lead-Free Status: Lead Free; Number of Contacts: 6; Pin Pitch: 2.54 mm; Voltage Rating (AC): 400 V; Gender: Female; Color: Black; Octopart URL: https://octopart.com/slw-103-01-t-d-samtec-292455; Mounting Style: Through Hole, Vertical; Contact Plating: Tin; OctopartID: bcf575fbeff46332; Operating Temperature: 105 °C (max); Size-Width: 4.95 mm; Housing Material: Plastic; Size-Length: 7.62 mm; Number of Rows: 2; Size-Height: 4.57 mm; Packaging: Tube; RoHS: Compliant; Contact Material: Phosphor Bronze; Number of Positions: 6; Housing Color: Black; REACH SVHC Compliance: No SVHC; Manufacturer Part Number: SLW-103-01-T-D; LCSC_PN: C492420
J4 = CMP-1502-01886-2: NexarPartId: 8917777; Number of Levels: 1; Voltage Rating: 300V; Gender: Male; Pitch: 3.81mm; Number of Positions Per Level: 2; Current Rating: 10A; Number of Pins: 2; Number of Rows: 1; Height: 7.2mm; Contact Material: Brass; Termination: Solder; Min Operating Temperature: -40°C; Max Operating Temperature: 105°C; Contact Plating: Tin; Number of Contacts: 2; REACH SVHC: Unknown; Color: Green; Packaging: Box; Voltage: 300V; Width: 9.01mm; Current: 10A; Length: 10.5mm; Mount: Through Hole; Lead Pitch: 3.81mm; RoHS: Compliant; LCSC_PN: C5188157
L1 = 104CDMCCDS-330MC: Inductor; Manufacturer_Name: Sumida; Datasheet Link: http://products.sumida.com/products/pdf/104CDMCCDS.pdf; Height: 4mm; Manufacturer_Part_Number: 104CDMCCDS-330MC; Mouser Part Number: 851-104CDMCCDS-330MC; Mouser Price/Stock: https://www.mouser.co.uk/ProductDetail/Sumida/104CDMCCDS-330MC?qs=D3efs7kfDkW3KXs3c4IVMQ%3D%3D; LCSC_PN: C2454199
L2 = CMP-06042-006799-1: Shielded Wirewound Inductor 3.3uH 30% 6800mA 0.0144Ω SMD; Saturation Current: 7.7A; Core Material: Ferrite; Current Rating: 6.8A; Test Frequency: 100kHz; DC Resistance (DCR): 14.4mR; Height - Seated (Max): 0.177inch; Packaging: Tape and Reel; Resistor Type: Wirewound; Tolerance: 30%; Inductance: 3.3uH; Length: 0.315inch; Number of Pins: 2; Case/Package: SMD/SMT; Mount: Surface Mount; Max DC Current: 6.8A; Width: 0.315inch; Shielding: Shielded; LCSC_PN: C160949
L3 = CMP-06042-016504-1: Multilayer Type Inductor for Power Lines, 0805 (2012), 1μH, 20%, 0.1Ω, 2A; Saturation Current: 1.1A; Current Rating: 1.7A; Inductance: 1uH; Core Material: Ferrite; Self Resonant Frequency: 60MHz; Shielding: Shielded; DC Resistance (DCR): 100mR; Test Frequency: 1MHz; Length: 0.079inch; Mount: Surface Mount; Case Code (Imperial): 0805; Max DC Current: 1.7A; Packaging: Tape and Reel; Height - Seated (Max): 0.039inch; Case Code (Metric): 2012; Min Operating Temperature: -40°C; Width: 0.049inch; Tolerance: 20%; Height: 0.9mm; Package Quantity: 3000; Lead Free: Lead Free; Case/Package: 0805; RoHS Compliant: Yes; Weight: 0.000194oz; Termination: SMD/SMT; Max Operating Temperature: 85°C; LCSC_PN: C703134
Q1 Q2 Q4 = CMP-2000-05968-1: N-Channel Enhancement Mode Mosfet, 50 V, 200 mA, -55 to 150 degC, 6-Pin SOT-323, RoHS, Tape and Reel; Typical Turn-Off Delay Time: 20ns; Number of Channels: 1Channel; Type: EnhancementModeFieldEffectTransistor; Brand: DiodesIncorporated; Vds - Drain-Source Breakdown Voltage: 75V; Vgs - Gate-Source Voltage: 20V; Rds On - Drain-Source Resistance: 1.4Ohms; Transistor Type: 1N-Channel; Configuration: Single; Unit Weight: 0.000212oz; Pd - Power Dissipation: 200mW; Id - Continuous Drain Current: 200mA; Forward Transconductance - Min: 0.1S; Manufacturer URL: http://www.diodes.com/; Series: BSS138; Package Description: 3-Pin Small Outline Transistor, Body 2 x 1.25 mm, Pitch 0.65 mm; Mounting Technology: SurfaceMount; Product Category: MOSFET; RoHS: True; Maximum Operating Temperature: +150C; Height: 1mm; Length: 2.2mm; Technology: Si; Width: 1.35mm; Datasheet URL: http://www.diodes.com/_files/datasheets/ds30206.pdf; Manufacturer: DiodesIncorporated; Package / Case: SOT-323-3; Typical Turn-On Delay Time: 20ns; Transistor Polarity: N-Channel; Factory Pack Quantity: 3000; Packaging: Reel; Product: MOSFETSmallSignal; Datasheet Version: Rev. 11-2, 09/2013; Package Reference: SOT323; Minimum Operating Temperature: -55C; Mounting Style: SMD/SMT; Channel Mode: Enhancement; LCSC_PN: C24553
Q3 = DMP10H400SK3-13: MOSFET (P-Channel); Manufacturer_Name: Diodes Incorporated; Datasheet Link: https://www.diodes.com//assets/Datasheets/DMP10H400SK3.pdf; Height: 2.52mm; Manufacturer_Part_Number: DMP10H400SK3-13; Mouser Part Number: 621-DMP10H400SK3-13; Mouser Price/Stock: https://www.mouser.co.uk/ProductDetail/Diodes-Incorporated/DMP10H400SK3-13?qs=wo71MgyKIyFqONaMc85PEA%3D%3D; Arrow Part Number: DMP10H400SK3-13; Arrow Price/Stock: https://www.arrow.com/en/products/dmp10h400sk3-13/diodes-incorporated?region=nac; LCSC_PN: C177034
R1-R56 R58-R70 = CMP-2002-07472-1
  R1 R5 R10 R11 R13 R18-R23 R30 R33 R34 R36 R42 R45 R47 R53 R55 R56 R58-R62: LCSC_PN: C190095
  R2 R29 R32 R41 R44 R46 R65 R66: LCSC_PN: C106235
  R3 R6 R8 R9 R25-R27 R31 R49 R50 R63 R64: LCSC_PN: C60485
  R4 R48: LCSC_PN: C93943
  R7: LCSC_PN: C137969
  R12: LCSC_PN: C852664
  R14: LCSC_PN: C409676
  R15 R16: LCSC_PN: C226722
  R17: LCSC_PN: C137925
  R24 R37: LCSC_PN: C482091
  R28 R35: LCSC_PN: C269831
  R38: LCSC_PN: C226767
  R39: LCSC_PN: C477223
  R40 R43 R67-R70: LCSC_PN: C227423
  R51 R52 R54: LCSC_PN: C106233
R57 = CMP-0abdc173b10ad57a-1: Manufacturer Part Number: WSLP12065L000FEA; Resistance: 0,002; Power: 1W; Octopart URL: https://octopart.com/1-2176055-0-te+connectivity-46440145; Case/Package: 1206; Lifecycle Status: Not Listed by Manufacturer; Packaging: Tape & Reel (TR); OctopartID: 0abdc173b10ad57a; OrderingCode: WSLP12065L000FEA; Manufacturer Part Number 2: FMF06FTHR005-LHL; LCSC_PN: C309661
RF_PCB1 = CMP-e704afk8c25r4a5ypw1c-12: GSM900 and GSM1800  Frequency Bands PCB antenna; CustomComponentID: e704afk8c25r4a5ypw1c
U1 = CMP-0069-01470-3: SIMPLE SWITCHER® 75V, 3A Step-Down Switching Regulator, 20-pin TSSOP-EP, Pb-Free; Manufacturer: Texas Instruments; PackageTopMarking: NSUZXYTT*LM5576*MH; PowerWise: Y; PackageReference: PWP0020A; CompType: Switcher; ComponentLink1Description: Datasheet URL; PinCount: 20; Code_JEDEC: MO-153-ACT; ComponentLink1URL: http://www.ti.com/general/docs/lit/getliterature.tsp?genericPartNumber=LM5576&fileType=pdf; PackageDescription: Molded TSSOP, Jedec, 6.5 x 4.4 x 0.9mm Body, 20 Lead, 0.65mm Pitch, Exposed Pad; RoHS: Y; LCSC_PN: C390950
U2 = CMP-04918-000435-1: POWER MANAGEMENT; LCSC_PN: C779412
U3 = CMP-2000-05282-1: NFC Controller, 13.56 MHz, -30 to 85 degC, 40-Pin HVQFN (SOT618-1), RoHS, Tray; Manufacturer: NXP Semiconductors; Supply Voltage - Min: 2.7V; Supply Voltage - Max: 5.5V; Brand: NXPSemiconductors; Supply Current: 12uA; RoHS: Details; Mounting Style: SMD/SMT; Packaging: Tray; Operating Frequency: 13.56MHz; Maximum Operating Temperature: +85C; Product Category: RFWirelessMisc; Datasheet Version: Rev. 1.2, 03/2011; Type: NearFieldTransmissionModule,Read/Write; Package / Case: QFN-40; Datasheet URL: https://datasheet.ciiva.com/1172/1391932-1172875.pdf; Factory Pack Quantity: 490; Manufacturer URL: http://www.nxp.com/; Minimum Operating Temperature: -25C; LCSC_PN: C28925
U4 = CMP-72dbb8ea0133ad1c-5: Module: GSM/Bluetooth; GPRS; 2G; 1800MHz, 900MHz; 85.6kbps; SMD; OctopartID: 72dbb8ea0133ad1c; Manufacturer Part Number: SIM800C; Mounting Style: Surface Mount; Octopart URL: http://octopart.com/sim800c-simcom-54220430; LCSC_PN: C2981431
U5 = CMP-2785eb2e468cf842-1: SMD Module ESP32-WOOM-32D; Manufacturer Part Number: ESP32-WOOM-32D; Octopart Url: https://octopart.com/esp32-solo-1-espressif+systems-94454895; OctopartID: 2785eb2e468cf842; Mounting Style: Surface Mount; Manufacturer Part Number 2: ESP32-WROOM-32; LCSC_PN: C473012
U6 = CMP-ce8f06c57f401148-2: Embedded SIM card in MFF2; DNP: DNP; LCSC_PN: C5122390
U7 = W5500: Integrated Circuit; Manufacturer_Name: WIZnet Inc; Datasheet Link: http://wizwiki.net/wiki/lib/exe/fetch.php?media=products:w5500:w5500_ds_v106e_141230.pdf; Height: 1.6mm; Manufacturer_Part_Number: W5500; Mouser Part Number: 950-W5500; Mouser Price/Stock: https://www.mouser.co.uk/ProductDetail/WIZnet/W5500?qs=2vh%252B45pPFtzthUpYPd4pqA%3D%3D; LCSC_PN: C32843
Y1 = XRCGB25M000F3A00R0: Crystal or Oscillator; Manufacturer_Name: Murata Electronics; Datasheet Link: https://www.murata.com/en-us/products/productdetail.aspx?cate=cgsubResonators&partno=XRCGB25M000F3A00R0; Height: 0.7mm; Manufacturer_Part_Number: XRCGB25M000F3A00R0; Mouser Part Number: 81-XRCGB25M000F3A0R0; Mouser Price/Stock: https://www.mouser.co.uk/ProductDetail/Murata-Electronics/XRCGB25M000F3A00R0?qs=CzouL7iWfZu%252BDUQ1kPudMw%3D%3D; Arrow Part Number: XRCGB25M000F3A00R0; Arrow Price/Stock: https://www.arrow.com/en/products/xrcgb25m000f3a00r0/murata-manufacturing?region=nac; LCSC_PN: C467842
Y3 = XRCGB27M120F3M10R0: Crystal or Oscillator; Manufacturer_Name: Murata Electronics; Datasheet Link: https://www.murata.com/products/productdata/8801063075870/SPEC-XRCGB27M120F3M10R0.pdf; Height: 0.7mm; Manufacturer_Part_Number: XRCGB27M120F3M10R0; Mouser Part Number: 81-XRCGB27M120F3M1R0; Mouser Price/Stock: https://www.mouser.co.uk/ProductDetail/Murata-Electronics/XRCGB27M120F3M10R0?qs=%2FU9ujJMYoOpT5lIgbwW5qQ%3D%3D; Arrow Part Number: XRCGB27M120F3M10R0; Arrow Price/Stock: https://www.arrow.com/en/products/xrcgb27m120f3m10r0/murata-manufacturing?region=nac; LCSC_PN: C338245